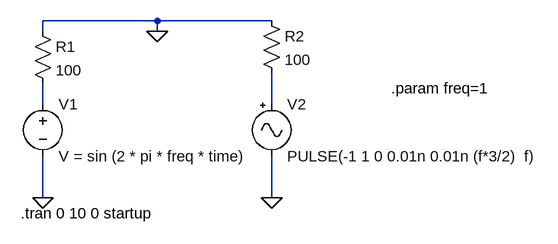
[diagram p0: schematic Draft1.asc]
Draft1.asc, the LTspice schematic file:
Version 4
SHEET 1 880 680
WIRE 256 0 80 0
WIRE 432 0 256 0
WIRE 80 16 80 0
WIRE 256 16 256 0
WIRE 80 128 80 96
WIRE 432 128 432 80
WIRE 80 272 80 208
WIRE 432 272 432 208
FLAG 80 272 0
FLAG 432 272 0
FLAG 256 16 0
SYMBOL Misc\\signal 432 112 R0
WINDOW 123 0 0 Left 2
WINDOW 39 0 0 Left 2
SYMATTR InstName V2
SYMATTR Value PULSE(-1 1 0 0.01n 0.01n (f*3/2)  f)
SYMBOL res 64 0 R0
SYMATTR InstName R1
SYMATTR Value 100
SYMBOL res 416 -16 R0
SYMATTR InstName R2
SYMATTR Value 100
SYMBOL voltage 80 112 R0
SYMATTR InstName V1
SYMATTR Value V = sin (2 * pi * freq * time)
TEXT 616 104 Left 2 !.param freq=1
TEXT 46 296 Left 2 !.tran 0 10 0 startup

The netlist it stands for:
* Draft1.asc
V2 N002 0 PULSE(-1 1 0 0.01n 0.01n (f*3/2)  f)
R1 0 N001 100
R2 0 N002 100
V1 N001 0 V = sin (2 * pi * freq * time)
.param freq=1
.tran 0 10 0 startup
.backanno
.end